# Altium project FEU-102-1_part1.PrjPcb
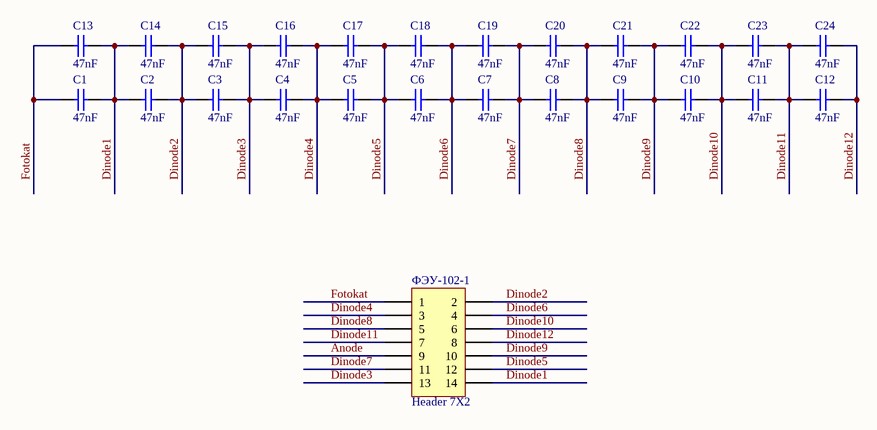
[diagram p0: FEU-102-1_part1.SchDoc]
1 sheet, 25 parts. Net scope: global (net labels, ports and power ports of the same name join across sheets).
Board file: FEU-102-1_part1.PcbDoc

## Sheet FEU-102-1_part1.SchDoc: Делитель ФЭУ-82
size A3; Address1: (с) Быканов Андрей; Address2: г.Тула 2016г.; Revision: 1

### Parts
C1  47nF  [0805_CAP]
C2  47nF  [0805_CAP]
C3  47nF  [0805_CAP]
C4  47nF  [0805_CAP]
C5  47nF  [0805_CAP]
C6  47nF  [0805_CAP]
C7  47nF  [0805_CAP]
C8  47nF  [0805_CAP]
C9  47nF  [0805_CAP]
C10  47nF  [0805_CAP]
C11  47nF  [0805_CAP]
C12  47nF  [0805_CAP]
C13  47nF  [0805_CAP]
C14  47nF  [0805_CAP]
C15  47nF  [0805_CAP]
C16  47nF  [0805_CAP]
C17  47nF  [0805_CAP]
C18  47nF  [0805_CAP]
C19  47nF  [0805_CAP]
C20  47nF  [0805_CAP]
C21  47nF  [0805_CAP]
C22  47nF  [0805_CAP]
C23  47nF  [0805_CAP]
C24  47nF  [0805_CAP]
ФЭУ-102-1  Header 7X2  [ФЭУ-102]

### Nets
Anode: ФЭУ-102-1.9
Dinode1: C1.1 C2.2 C13.1 C14.2 ФЭУ-102-1.14
Dinode2: C2.1 C3.2 C14.1 C15.2 ФЭУ-102-1.2
Dinode3: C3.1 C4.2 C15.1 C16.2 ФЭУ-102-1.13
Dinode4: C4.1 C5.2 C16.1 C17.2 ФЭУ-102-1.3
Dinode5: C5.1 C6.2 C17.1 C18.2 ФЭУ-102-1.12
Dinode6: C6.1 C7.2 C18.1 C19.2 ФЭУ-102-1.4
Dinode7: C7.1 C8.2 C19.1 C20.2 ФЭУ-102-1.11
Dinode8: C8.1 C9.2 C20.1 C21.2 ФЭУ-102-1.5
Dinode9: C9.1 C10.2 C21.1 C22.2 ФЭУ-102-1.10
Dinode10: C10.1 C11.2 C22.1 C23.2 ФЭУ-102-1.6
Dinode11: C11.1 C12.2 C23.1 C24.2 ФЭУ-102-1.7
Dinode12: C12.1 C24.1 ФЭУ-102-1.8
Fotokat: C1.2 C13.2 ФЭУ-102-1.1

### Notes on the sheet
- Title
- Size:
- Date:
- A3
- Number:
- Time:
- Revision:
- Sheet
- of
- File:

### Library data of the parts
C1-C24 = Cap Semi: Capacitor (Semiconductor SIM Model); Order: CGA4J4X7T2W473M/SOFT; Published: 8-Jun-2000; LatestRevisionDate: 29-May-2009; LatestRevisionNote: IPC-7351 Footprint Added.; PackageReference: C1206; Publisher: Altium Limited; PackageDescription: Chip Capacitor; Value: 47nF
ФЭУ-102-1 = Header 7X2: Header, 7-Pin, Dual row; LatestRevisionDate: 17-Jul-2002; LatestRevisionNote: Re-released for DXP Platform.; Publisher: Altium Limited